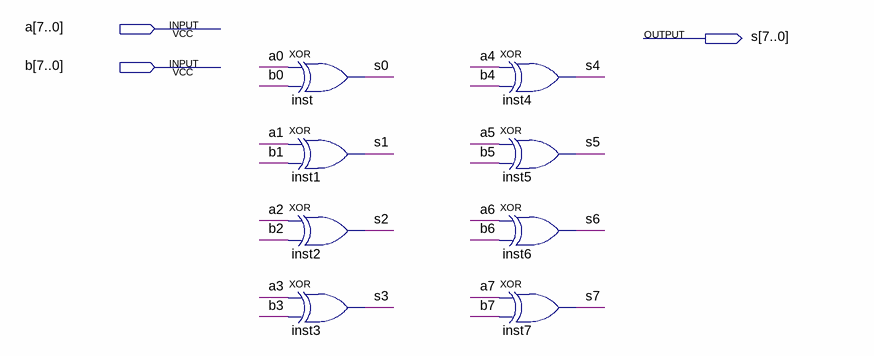
[diagram p0: schematic sheet]
// Quartus schematic abk_xor8.bdf as structural Verilog: 8 symbols, 3 pins
module abk_xor8 (
  input  [7:0] a,
  input  [7:0] b,
  output [7:0] s
);

  xor inst (s[0], a[0], b[0]);
  xor inst1 (s[1], a[1], b[1]);
  xor inst2 (s[2], a[2], b[2]);
  xor inst3 (s[3], a[3], b[3]);
  xor inst4 (s[4], a[4], b[4]);
  xor inst5 (s[5], a[5], b[5]);
  xor inst6 (s[6], a[6], b[6]);
  xor inst7 (s[7], a[7], b[7]);
endmodule
